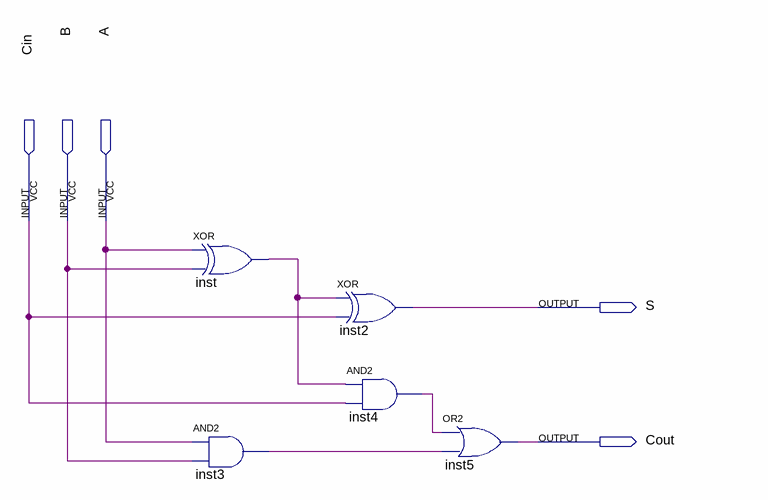
[diagram p0: schematic sheet]
// Quartus schematic FullAdder.bdf as structural Verilog: 5 symbols, 5 pins
module FullAdder (
  input  Cin,
  input  B,
  input  A,
  output S,
  output Cout
);

  wire inst3_out, inst4_out, inst_out;

  xor inst (inst_out, A, B);
  and inst3 (inst3_out, A, B);
  xor inst2 (S, inst_out, Cin);
  and inst4 (inst4_out, inst_out, Cin);
  or inst5 (Cout, inst4_out, inst3_out);
endmodule
